# EasyEDA Pro project CH55xFanCtl.epro

# Schematic CH55xFanCtl
Create Date: 2024-06-23; Page Name: P1; Project Name: 3盘位热插拔硬盘柜FRHD-SAS-3C-A; Schematic Name: 小板; Update Date: 2024-09-22; Company: LLL; Page Size: A4; Version: V1.0
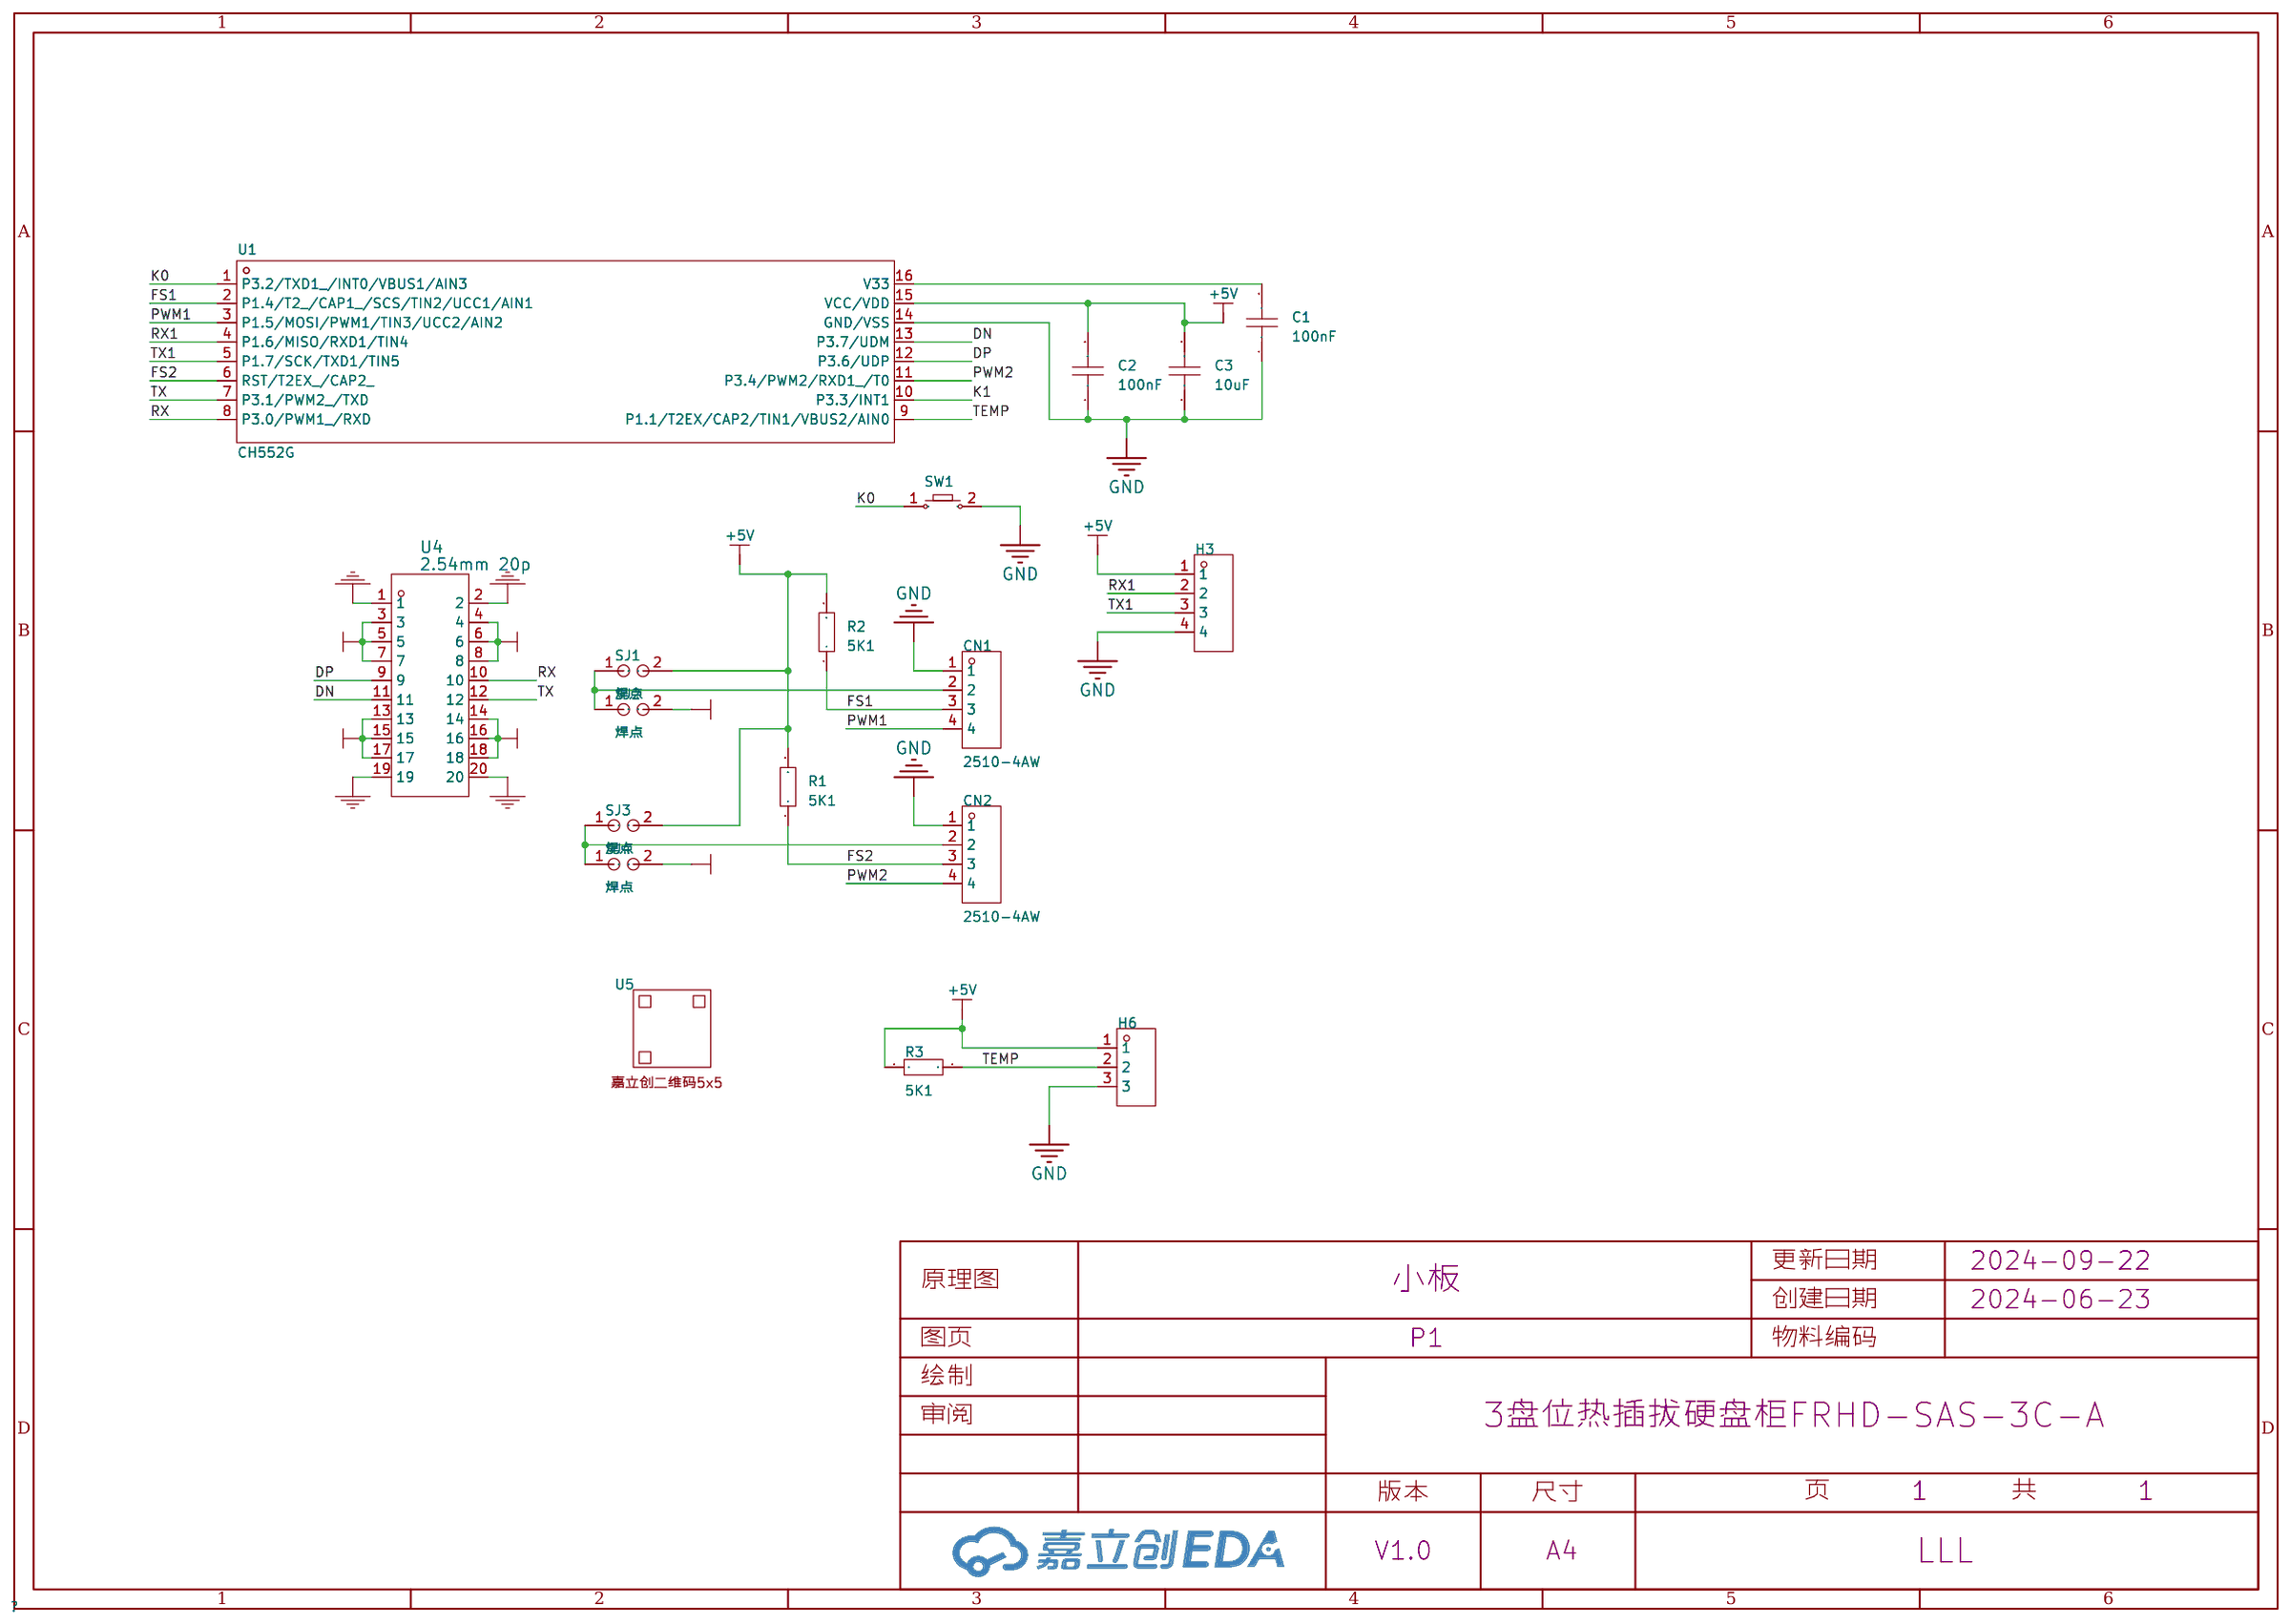
[diagram p0: schematic sheet]

## Parts
C1  100nF  [C0805]
C2  100nF  [C0805]
C3  10uF  [C0805]
CN1  2510-4AW  [CONN-TH_2510-4AW]
CN2  2510-4AW  [CONN-TH_2510-4AW]
H3  -  [HDR-TH_4P-P2.54-V-F]
H6  -  [HDR-TH_3P-P2.54-V-F]
R1  5K1  [R0805]
R2  5K1  [R0805]
R3  5K1  [R0805]
SJ1  焊点  [TOGO_MODE]
SJ2  焊点  [TOGO_MODE]
SJ3  焊点  [TOGO_MODE]
SJ4  焊点  [TOGO_MODE]
SW1  -  [Key_SMD_3.6x6.1x2.5]
U1  CH552G  [SOP-16_L10.0-W3.9-P1.27-LS6.0-BL]
U4  2.54mm 20p  [2.54MM 20P]
U5  -  [JLC-QRCODE-5x5]

## Library data of the parts
C1-C3 = CAP_0805: Supplier Footprint: 0805
CN1 CN2 = 2510-4AW: 插针结构:1x4P;间距:2.54mm;安装方式:弯插;参考系列:-;总PIN数:4P;排数:1;每排PIN数:4;行距:-;额定电流:3A;工作温度范围:-25℃~+85℃;; LCSC Part Name: 1x4P 间距:2.54mm 弯插; Supplier Part: C722720; Manufacturer: CAX(创都); Supplier Footprint: 弯插,P=2.54mm; JLCPCB Part Class: Extended Part; Datasheet: https://atta.szlcsc.com/upload/public/pdf/source/20200903/C722713_133F33CE5FD78EE343A9136080FC3DEA.pdf; Supplier: LCSC; Pins Structure: 1x4P; Pitch: 2.54mm; Mounting Style: 弯插; Number of Pins: 4P; Number of Rows: 1; Number of PINs Per Row: 4; Current Rating (Max): 3A; Operating Temperature Range: -25℃~+85℃
H3 = HDR-F_2.54_1x4P: Supplier Part: C2718488; Supplier Footprint: 插件
H6 = HDR-F_2.54_1x3P: Supplier Part: C541850; Supplier Footprint: 插件
R1-R3 = Res_0805: Supplier Footprint: 0805
SJ1-SJ4 = 焊点
SW1 = Key_SMD_3.6x6.1x2.5: Supplier Footprint: SMD
U1 = CH552G: CPU内核:51系列;程序存储容量:16KB;RAM总容量:1.25KB;GPIO端口数量:-;工作电压范围:3.3V~5V;CPU最大主频:24MHz;程序存储器类型:FLASH;; Supplier Part: C111292; Manufacturer: WCH(南京沁恒); Supplier Footprint: SOP-16; JLCPCB Part Class: 扩展库; Datasheet: https://atta.szlcsc.com/upload/public/pdf/source/20200819/C111292_2988E0DDEDF937C7B5A075A68BF2AC9C.pdf; Supplier: LCSC; CPU Core: 51系列; Program Storage Size: 16KB; RAM Size: 1.25KB; Operating Voltage Range: 3.3V~5V; CPU Maximum Speed: 24MHz; Program Memory Type: FLASH; Operating Temperature Range: -40℃~+85℃; ADC (Bit): 8bit; PWM (Bit): 8bit; 16Bit Timer: 3; UART/USART: 2; SPI: 1; Universal Serial Bus: 有; Peripheral/Function: DMA；看门狗；CCP捕获/比较；触控按键; Watchdog: 有; CCP Capture/Compare: 有; Direct Memory Access: 有; Internal Oscillator: 有
U4 = 2.54mm 20p
U5 = 嘉立创二维码5x5

## Nets
+5V: C2.2 C3.2 H3.1 H6.1 R1.2 R2.2 R3.2 SJ1.2 SJ3.2 U1.15(VCC/VDD) U4.13 U4.14 U4.15 U4.16 U4.17 U4.18
+12V: SJ2.2 SJ4.2 U4.3 U4.4 U4.5 U4.6 U4.7 U4.8
GND: C1.1 C2.1 C3.1 CN1.1 CN2.1 H3.4 H6.3 SW1.2 U1.14(GND/VSS) U4.1 U4.2 U4.19 U4.20
DN: U1.13(P3.7/UDM) U4.11
DP: U1.12(P3.6/UDP) U4.9
FS1: CN1.3 R2.1 U1.2(P1.4/T2_/CAP1_/SCS/TIN2/UCC1/AIN1)
FS2: CN2.3 R1.1 U1.6(RST/T2EX_/CAP2_)
K0: SW1.1 U1.1(P3.2/TXD1_/INT0/VBUS1/AIN3)
K1: U1.10(P3.3/INT1)
PWM1: CN1.4 U1.3(P1.5/MOSI/PWM1/TIN3/UCC2/AIN2)
PWM2: CN2.4 U1.11(P3.4/PWM2/RXD1_/T0)
RX: U1.8(P3.0/PWM1_/RXD) U4.10
RX1: H3.2 U1.4(P1.6/MISO/RXD1/TIN4)
TEMP: H6.2 R3.1 U1.9(P1.1/T2EX/CAP2/TIN1/VBUS2/AIN0)
TX: U1.7(P3.1/PWM2_/TXD) U4.12
TX1: H3.3 U1.5(P1.7/SCK/TXD1/TIN5)
$1N2146: C1.2 U1.16(V33)
$1N5249: CN1.2 SJ1.1 SJ2.1
$1N5258: CN2.2 SJ3.1 SJ4.1

# Board CH55xFanCtl
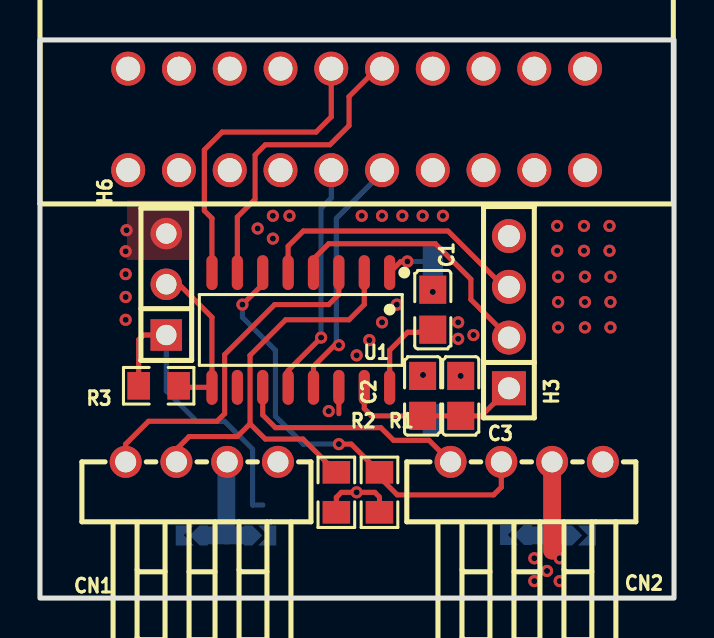
[diagram p1: board, top side]
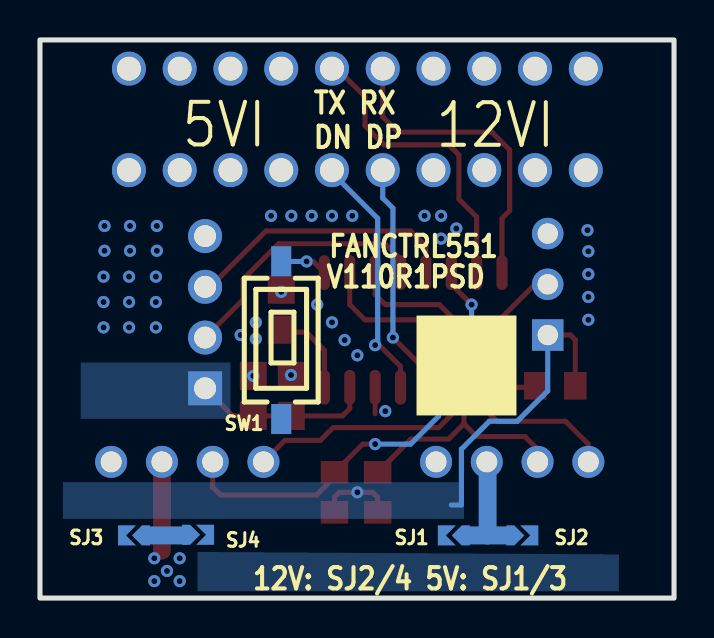
[diagram p2: board, bottom side, seen from below]

Outline 31.73 x 27.94 mm; copper layers: Top Layer, Bottom Layer. Coordinates in mm from the lower left corner of the outline.
Outline path: rectangle 0,27.94 31.73,0
Stack: Top Layer 0.035mm / Dielectric1 1.51mm FR4 er 4.5 / Bottom Layer 0.035mm

## Design rules (mm)
template: 自定义配置
spacing copperThickness1oz (default): track to track 0.102, other pairs 0.152 to 0.3
spacing copperThickness2oz: track to track 0.203, other pairs 0.152 to 0.3
track width copperThickness1oz (default): min 0.127, default 0.254, max 2.54
track width copperThickness2oz: min 0.203, default 0.254, max 2.54
differential pair differentialPair (default): width min 0.127, default 0.254, max 2.54; gap min 0.152, default 0.152
via viaSize (default): diameter min 0.5, default 0.61, max 10; hole min 0.3, default 0.305, max 6.3

## Placement (name value [footprint] x y rotation side)
C1  100nF  [C0805]  19.66 14.44 270 top
C2  100nF  [C0805]  19.15 10.12 270 top
C3  10uF  [C0805]  21.05 10.12 270 top
CN1  2510-4AW  [CONN-TH_2510-4AW]  8.1 6.82 0 top
CN2  2510-4AW  [CONN-TH_2510-4AW]  24.35 6.82 0 top
H3  -  [HDR-TH_4P-P2.54-V-F]  23.47 14.31 90 top
H6  -  [HDR-TH_3P-P2.54-V-F]  6.32 15.71 90 top
R1  5K1  [R0805]  16.99 5.29 270 top
R2  5K1  [R0805]  14.83 5.29 270 top
R3  5K1  [R0805]  5.94 10.63 180 top
SJ1  焊点  [TOGO_MODE]  11.02 3.13 0 bottom
SJ2  焊点  [TOGO_MODE]  7.59 3.13 180 bottom
SJ3  焊点  [TOGO_MODE]  27.02 3.13 0 bottom
SJ4  焊点  [TOGO_MODE]  23.81 3.17 180 bottom
SW1  -  [Key_SMD_3.6x6.1x2.5]  19.66 12.91 270 bottom
U1  CH552G  [SOP-16_L10.0-W3.9-P1.27-LS6.0-BL]  13.05 13.42 180 top
U4  2.54mm 20p  [2.54MM 20P]  -0.03 19.77 90 top
U5  -  [JLC-QRCODE-5x5]  10.38 11.64 180 bottom

## Footprints (pads in the part's own frame, mm; a bottom-side part is the same pattern mirrored in y, then rotated)
2.54MM 20P
  round 1.7 hole 1.2: 1(1.651,-4.445) 2(6.731,-4.445) 3(1.651,-6.985) 4(6.731,-6.985) 5(1.651,-9.525) 6(6.731,-9.525) 7(1.651,-12.065) 8(6.731,-12.065) 9(1.651,-14.605) 10(6.731,-14.605) 11(1.651,-17.145) 12(6.731,-17.145) 13(1.651,-19.685) 14(6.731,-19.685) 15(1.651,-22.225) 16(6.731,-22.225) 17(1.651,-24.765) 18(6.731,-24.765) 19(1.651,-27.305) 20(6.731,-27.305)
C0805
  rect 1.41x1.35 smd: 1(-1,0) 2(1,0)
CONN-TH_2510-4AW
  round 1.6 hole 1.05: 1(3.81,0) 2(1.27,0) 3(-1.27,0) 4(-3.81,0)
HDR-TH_3P-P2.54-V-F
  rect 1.575x1.575 hole 1.02: 1(-2.54,0)
  round 1.575 hole 1.02: 2(0,0) 3(2.54,0)
HDR-TH_4P-P2.54-V-F
  rect 1.7x1.7 hole 1.1: 1(-3.81,0)
  round 1.7 hole 1.1: 2(-1.27,0) 3(1.27,0) 4(3.81,0)
Key_SMD_3.6x6.1x2.5
  rect 1.501x1.001 smd: 1(-3.95,0) 2(3.95,0)
R0805
  rect 1.133x1.377 smd: 1(-1,0) 2(1,0)
SOP-16_L10.0-W3.9-P1.27-LS6.0-BL
  oval 0.56x1.745 smd: 1(-4.445,-2.873) 2(-3.175,-2.873) 3(-1.905,-2.873) 4(-0.635,-2.873) 5(0.635,-2.873) 6(1.905,-2.873) 7(3.175,-2.873) 8(4.445,-2.873) 9(4.445,2.873) 10(3.175,2.873) 11(1.905,2.873) 12(0.635,2.873) 13(-0.635,2.873) 14(-1.905,2.873) 15(-3.175,2.873) 16(-4.445,2.873)
TOGO_MODE
  custom 0.9x1 smd: 1(-0.6,0) 2(0.6,0)

## Nets
As in the schematic.

## Via types
v1: diameter 0.61, hole 0.305, Top Layer to Bottom Layer, 51 vias

## Routing (per net, layer and track width the routed paths; a pad name or vN(x,y) marks a point on that pad's centre or on a via; arc(x,y) is an arc through that point)
+5V: length 28.3
  Top Layer w0.254: H3.1 22.08,9.12 C3.2 C2.2 16.59,9.12 16.23,9.48 U1.15 ; R3.2 4.94,12.93 5.18,13.17 H6.1 ; R2.2 14.83,5.04 15.08,5.29 v1(15.84,5.29) 16.75,5.29 16.99,5.06 R1.2
  Bottom Layer w0.254: H6.1 6.32,10.37 7.84,8.85 9.24,8.85 10.64,7.45 10.64,4.66 11.15,4.66
GND: length 1.3
  Top Layer w0.254: U1.14 14.96,9.23
  vias: v1(4.29,17.36) v1(4.29,16.22) v1(4.29,15.07) v1(4.29,13.93) v1(4.33,18.41) v1(10.89,18.5) v1(11.65,19.14) v1(11.65,17.99) v1(12.48,19.14) v1(14.45,9.36) v1(15.84,12.15) v1(16.1,19.14) v1(16.48,12.91) v1(17.12,19.14) v1(17.12,13.8) v1(17.85,14.69) v1(18.13,19.14) v1(19.15,19.14) v1(19.17,11.17) v1(19.66,15.33) v1(20.16,19.14) v1(20.93,13.8) v1(20.93,12.98) v1(21.05,11.12) v1(21.69,13.17) v1(25.88,18.63) v1(25.88,17.39) v1(25.93,16.09) v1(25.93,14.82) v1(25.93,13.55) v1(27.22,18.63) v1(27.22,17.39) v1(27.27,16.09) v1(27.27,14.82) v1(27.27,13.55) v1(28.5,18.63) v1(28.5,17.39) v1(28.54,16.09) v1(28.54,14.82) v1(28.54,13.55)
DN: length 12.5
  Top Layer w0.254: v1(14.96,12.66) 14.75,12.66 13.69,11.6 U1.13
  Bottom Layer w0.254: U4.11 17.12,21.3 14.83,19.01 14.83,12.79 v1(14.96,12.66)
DP: length 11.8
  Top Layer w0.254: U1.12 12.42,11.39 v1(14.07,13.04)
  Bottom Layer w0.254: U4.9 14.57,20.03 14.07,19.52 v1(14.07,13.04)
FS1: length 22
  Top Layer w0.254: U1.2 16.23,14.69 15.46,13.93 12.29,13.93 10.51,12.15 10.51,8.72 ; CN1.3 6.83,7.45 7.46,8.09 9.88,8.09 10.51,8.72 ; R2.1 13.16,7.96 11.27,7.96 10.51,8.72
FS2: length 22.8
  Top Layer w0.254: v1(14.96,7.71) 15.57,7.71 R1.1 16.99,6.06 17.88,5.17 22.7,5.17 23.08,5.55 CN2.3 ; U1.6 11.02,16.17 11.02,15.58 v1(10.13,14.69)
  Bottom Layer w0.254: v1(10.13,14.69) 10.13,14.06 11.78,12.41 11.78,9.1 13.18,7.71 v1(14.96,7.71)
K0: length 2.4
  Top Layer w0.254: U1.1 18.05,16.85 v1(18.38,16.85)
  Bottom Layer w0.254: v1(18.38,16.85) 19.64,16.85 SW1.1
PWM1: length 17.5
  Top Layer w0.254: U1.3 14.96,15.2 14.45,14.69 11.74,14.69 9.24,12.19 9.24,9.23 8.86,8.85 5.43,8.85 4.29,7.71 CN1.4
PWM2: length 11.8
  Top Layer w0.254: U1.11 11.15,9.16 11.78,8.53 17.06,8.53 17.69,7.89 19.47,7.89 CN2.4
RX: length 15.7
  Top Layer w0.254: U4.10 14.57,24.09 13.81,23.33 9.11,23.33 8.22,22.44 8.22,19.39 8.61,19.01 U1.8
RX1: length 13.3
  Top Layer w0.254: H3.2 21.56,14.95 21.56,15.96 19.78,17.74 14.45,17.74 13.69,16.98 U1.4
TEMP: length 8.2
  Top Layer w0.254: R3.1 7.02,10.55 U1.9 8.61,14.06 6.96,15.71 H6.2
TX: length 15.3
  Top Layer w0.254: U4.12 16.86,26.5 15.46,25.11 15.46,23.65 14.51,22.69 11.27,22.69 10.76,22.18 10.76,19.97 9.88,19.08 U1.7
TX1: length 13.8
  Top Layer w0.254: U1.5 12.42,17.61 13.18,18.37 20.42,18.37 23.34,15.45
$1N2146: length 4.4
  Top Layer w0.254: C1.2 19.53,13.31 18.4,13.31 17.5,12.41 U1.16
$1N5249: length 5.9
  Bottom Layer w0.889: 9.33,3.13 SJ2.1 ; 9.33,3.13 9.33,6.78 CN1.2 ; 9.33,3.13 SJ1.1
$1N5258: length 6.5
  Top Layer w0.889: CN2.2 25.62,2.37
  Bottom Layer w0.889: SJ3.1 24.45,3.13 SJ4.1
  vias: v1(24.73,1.99) v1(24.73,0.85) v1(25.37,1.36) v1(26,1.99) v1(26,0.85)

## Copper pours and planes (outline as drawn; the poured copper is in the pictures)
+5V on Bottom Layer: 29.43,28.03 31.69,28.03 31.69,0.04 29.43,0.06
+5V on Bottom Layer: 11.02,5.8 12.16,5.8 12.17,2.5 11.02,2.5
+5V on Bottom Layer: 22.19,11.79 29.69,11.79 29.69,8.97 22.19,8.97
+5V on Bottom Layer: 26.87,0.23 26.87,4.21 30.27,4.25 30.27,0.24
+5V on Bottom Layer: 10.51,5.8 30.58,5.8 30.58,3.96 10.51,3.96
+5V on Bottom Layer: 18.48,27.94 31.69,27.94 31.69,19.73 18.48,19.73
+12V on Bottom Layer: 22.69,3.74 23.87,3.74 23.91,0.47 22.7,0.47
+12V on Bottom Layer: 6.43,3.61 7.61,3.61 7.65,0.34 6.44,0.34
+12V on Bottom Layer: 0.22,20.28 3.02,20.28 3.02,0.17 0,0.17 0,20.06
+12V on Bottom Layer: 2.76,2.31 23.85,2.31 23.85,0.34 2.76,0.34
+12V on Bottom Layer: 13.18,27.77 13.18,19.9 -0.03,19.9 -0.03,28.03 13.01,27.94
GND on Top Layer: 0.22,20.03 23.98,20.03 23.77,0.18 0.22,0.09
GND on Top Layer: 0,27.98 18.78,27.98 18.78,19.73 0,19.73
GND on Top Layer: 4.36,19.9 7.59,19.9 7.59,16.92 4.36,16.92
GND on Top Layer: 15.46,27.77 26.64,27.77 26.51,18.63 15.46,18.63
GND on Top Layer: 22.31,27.94 31.69,27.94 31.69,2.96 22.33,3.02
GND on Top Layer: 11.15,20.03 11.15,18.65 20.57,18.65 21.33,19.41 21.33,19.87 21.18,20.03
GND on Bottom Layer: 29.31,19.39 3.14,19.73 3.14,5.68 29.31,5.93
$1N5258 on Top Layer: 24.11,2.86 26.79,2.86 26.79,0.28 24.11,0.28
$1N5258 on Bottom Layer: 24.09,2.79 26.77,2.79 26.77,0.21 24.09,0.21

Small or netless copper shapes (teardrops, artwork), in the pictures only: 2 on Top Layer, 4 on Bottom Layer

## Text on the board
Bottom Silkscreen Layer: TX RX / DN DP | 12V: SJ2/4 5V: SJ1/3 | FANCTRL551 | V110R1PSD | 12VI | 5VI
